# EAGLE design IRSolarSensor (EAGLE 6.5.0)
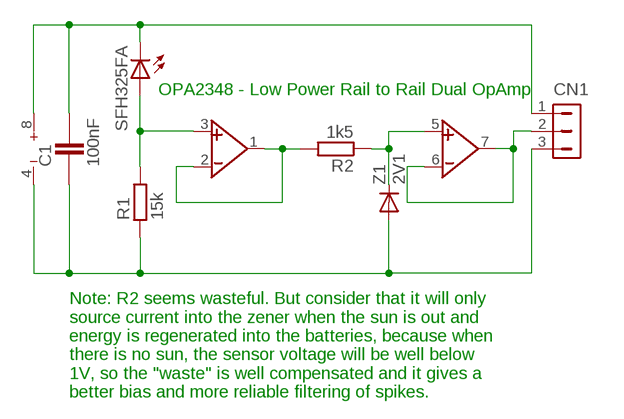
[diagram p0: schematic, sheet 1]

## Parts
C1  100nF  CAPACITOR_0603  [CAPC1608X92N]
CN1  HDR-1X3-MTA-100  [MTA-100-3V]
R1  15k  RESISTOR_0805  [RESC2012X70N]
R2  1k5  RESISTOR_0603  [RESC1608X55N]
SFH325FA  LEDSIDELED  [OSRAM-SIDELED]
U$1  OPA2348  [DCN-R-PDSO-G8]
Z1  2V1  DIODE-MINIMELF  [MINIMELF]

## Nets
BUFFER: R2.2 U$1.1(O) U$1.2(-)
GND: C1.1 CN1.3 R1.1 U$1.4(V-) Z1.A
N$3: R2.1 U$1.5(+) Z1.C
OUT: CN1.2 U$1.6(-) U$1.7(O)
SENSOR: R1.2 SFH325FA.A U$1.3(+)
VCC: C1.2 CN1.1 SFH325FA.C U$1.8(V+)

## Notes on the sheet
- OPA2348 - Low Power Rail to Rail Dual OpAmp
- Note: R2 seems wasteful. But consider that it will only
  source current into the zener when the sun is out and
  energy is regenerated into the batteries, because when
  there is no sun, the sensor voltage will be well below
  1V, so the "waste" is well compensated and it gives a
  better bias and more reliable filtering of spikes.

## Library data of the parts
C1 = ipc-7351-capacitor:CAPACITOR_
CN1 = con-hdrs40:HDR-1X3: HEADER CONNECTOR
R1 R2 = ipc-7351-resistor:RESISTOR_
SFH325FA = led:LED: LED OSRAM: - CHIPLED LG R971, LG N971, LY N971, LG Q971, LY Q971, LO R971, LY R971 LH N974, LH R974 LS Q976, LO Q976, LY Q976 LO Q996 - Hyper CHIPLED LW Q18S LB Q993, LB Q99A, LB R99A - SideLED LS A670, LO A670, LY A670, LG A670, LP A670 LB A673, LV A673, LT A673, LW A673 LH A674 LY A675 LS A676, LA A676, LO A676, LY A676, LW A676 LS A679, LY A679, LG A679 - Hyper Micro SIDELED® LS Y876, LA Y876, LO Y876, LY Y876 LT Y87S - SmartLED LW L88C, LW L88S LB L89C, LB L89S, LG L890 LS L89K, LO L89K, LY L89K LS L896, LA L896, LO L896, LY L896 - TOPLED LS T670, LO T670, LY T670, LG T670, LP T670 LSG T670, LSP T670, LSY T670, LOP T670, LYG T670 LG T671, LOG T671, LSG T671 LB T673, LV T673, LT T673, LW T673 LH T674 LS T676, LA T676, LO T676, LY T676, LB T676, LH T676, LSB T676, LW T676 LB T67C, LV T67C, LT T67C, LS T67K, LO T67K, LY T67K, LW E67C LS E67B, LA E67B, LO E67B, LY E67B, LB E67C, LV E67C, LT E67C LW T67C LS T679, LY T679, LG T679 LS T770, LO T770, LY T770, LG T770, LP T770 LB T773, LV T773, LT T773, LW T773 LH T774 LS E675, LA E675, LY E675, LS T675 LS T776, LA T776, LO T776, LY T776, LB T776 LHGB T686 LT T68C, LB T68C - Hyper Mini TOPLED® LB M676 - Mini TOPLED Santana® LG M470 LS M47K, LO M47K, LY M47K Source: http://www.osram.convergy.de LUXEON: - LUMILED® LXK2-PW12-R00, LXK2-PW12-S00, LXK2-PW14-U00, LXK2-PW14-V00 LXK2-PM12-R00, LXK2-PM12-S00, LXK2-PM14-U00 LXK2-PE12-Q00, LXK2-PE12-R00, LXK2-PE12-S00, LXK2-PE14-T00, LXK2-PE14-U00 LXK2-PB12-K00, LXK2-PB12-L00, LXK2-PB12-M00, LXK2-PB14-N00, LXK2-PB14-P00, LXK2-PB14-Q00 LXK2-PR12-L00, LXK2-PR12-M00, LXK2-PR14-Q00, LXK2-PR14-R00 LXK2-PD12-Q00, LXK2-PD12-R00, LXK2-PD12-S00 LXK2-PH12-R00, LXK2-PH12-S00 LXK2-PL12-P00, LXK2-PL12-Q00, LXK2-PL12-R00 Source: www.luxeon.com KINGBRIGHT: KA-3528ASYC Source: www.kingbright.com
U$1 = texas:OPA2348
Z1 = diode:DIODE-: DIODE

## Board
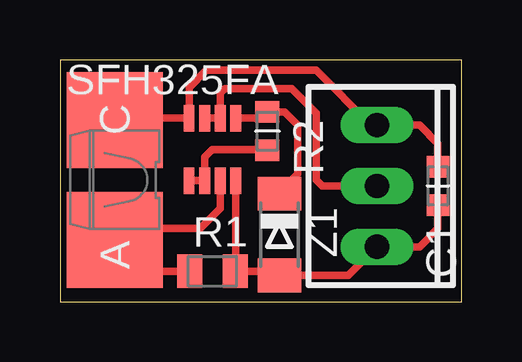
[diagram p1: board, top side]

Size 16.74 x 10.08 mm. Coordinates in mm from the lower left corner, seen from the top.
Outline: 0,0 16.74,0 16.74,10.08 0,10.08 0,0
Copper layers (1*16): Top 0.035mm / dielectric 1.5mm / Bottom 0.035mm
Design rules "default": minimum track width 10mil, minimum drill 24mil, track to track 8mil, track to pad 8mil, pad to pad 8mil, via to via 8mil, smd to smd 8mil, copper to edge 40mil, drill to drill 8mil, minimum pad ring 10mil, minimum via ring 8mil, stop-mask expansion 4mil, vias tented up to drill 0mil, thermal gap 10mil

### Footprints (pad centres in the part's own frame; a part is rotated, then mirrored left to right if it is on the bottom)
CAPC1608X92N = smd 0.9 x 0.95: 1 -0.8,0; 2 0.8,0
MTA-100-3V = drill 1.016 long: 1 -2.54,0; 2 0,0; 3 2.54,0
RESC2012X70N = smd 1.05 x 1.4: 1 -0.95,0; 2 0.95,0
RESC1608X55N = smd 0.9 x 1: 1 -0.8,0; 2 0.8,0
OSRAM-SIDELED = smd 4 x 4: A 0,2.5; C 0,-2.5
DCN-R-PDSO-G8 = smd 0.45 x 1.1: 1 -0.975,-1.3; 2 -0.325,-1.3; 3 0.325,-1.3; 4 0.975,-1.3; 5 0.975,1.3; 6 0.325,1.3; 7 -0.325,1.3; 8 -0.975,1.3
MINIMELF = smd 1.4 x 1.8: A 1.7,0; C -1.7,0

### Placement (x,y rotation side)
C1  15.75,4.83 90 top
CN1  13.21,4.83 270 top
R1  6.35,1.27 180 top
R2  8.64,7.11 270 top
SFH325FA  2.29,5.08 180 top
U$1  6.35,6.35 0 top
Z1  9.14,2.79 270 top

### Tracks (layer width: path | path; a pad name or v marks a point on that pad's centre or on a via)
BUFFER
  Top 0.305: U$1.1 U$1.2 6.03,6.03 6.35,6.35 8.6,6.35 R2.2
GND
  Top 0.305: U$1.4 7.33,1.29 R1.1 8.97,1.27 Z1.A 12.02,1.09 CN1.3 14.99,2.29 15.75,3.05 C1.1
N$3
  Top 0.305: U$1.5 8.37,7.65 R2.1 9.36,7.91 9.91,7.37 9.91,5.33 9.14,4.57 Z1.C
OUT
  Top 0.305: U$1.7 U$1.6 6.67,8.71 6.86,8.89 9.65,8.89 10.67,7.87 10.67,5.08 10.92,4.83 CN1.2
SENSOR
  Top 0.305: U$1.3 6.67,3.88 5.84,3.05 3.01,3.05 SFH325FA.A 3.34,1.27 R1.2
VCC
  Top 0.305: SFH325FA.C 2.61,7.65 U$1.8 5.38,8.93 6.1,9.65 10.67,9.65 12.95,7.37 CN1.1 14.99,7.37 15.75,6.6 C1.2